# Altium schematic sheet ARC-S-MCU.SchDoc
size A3
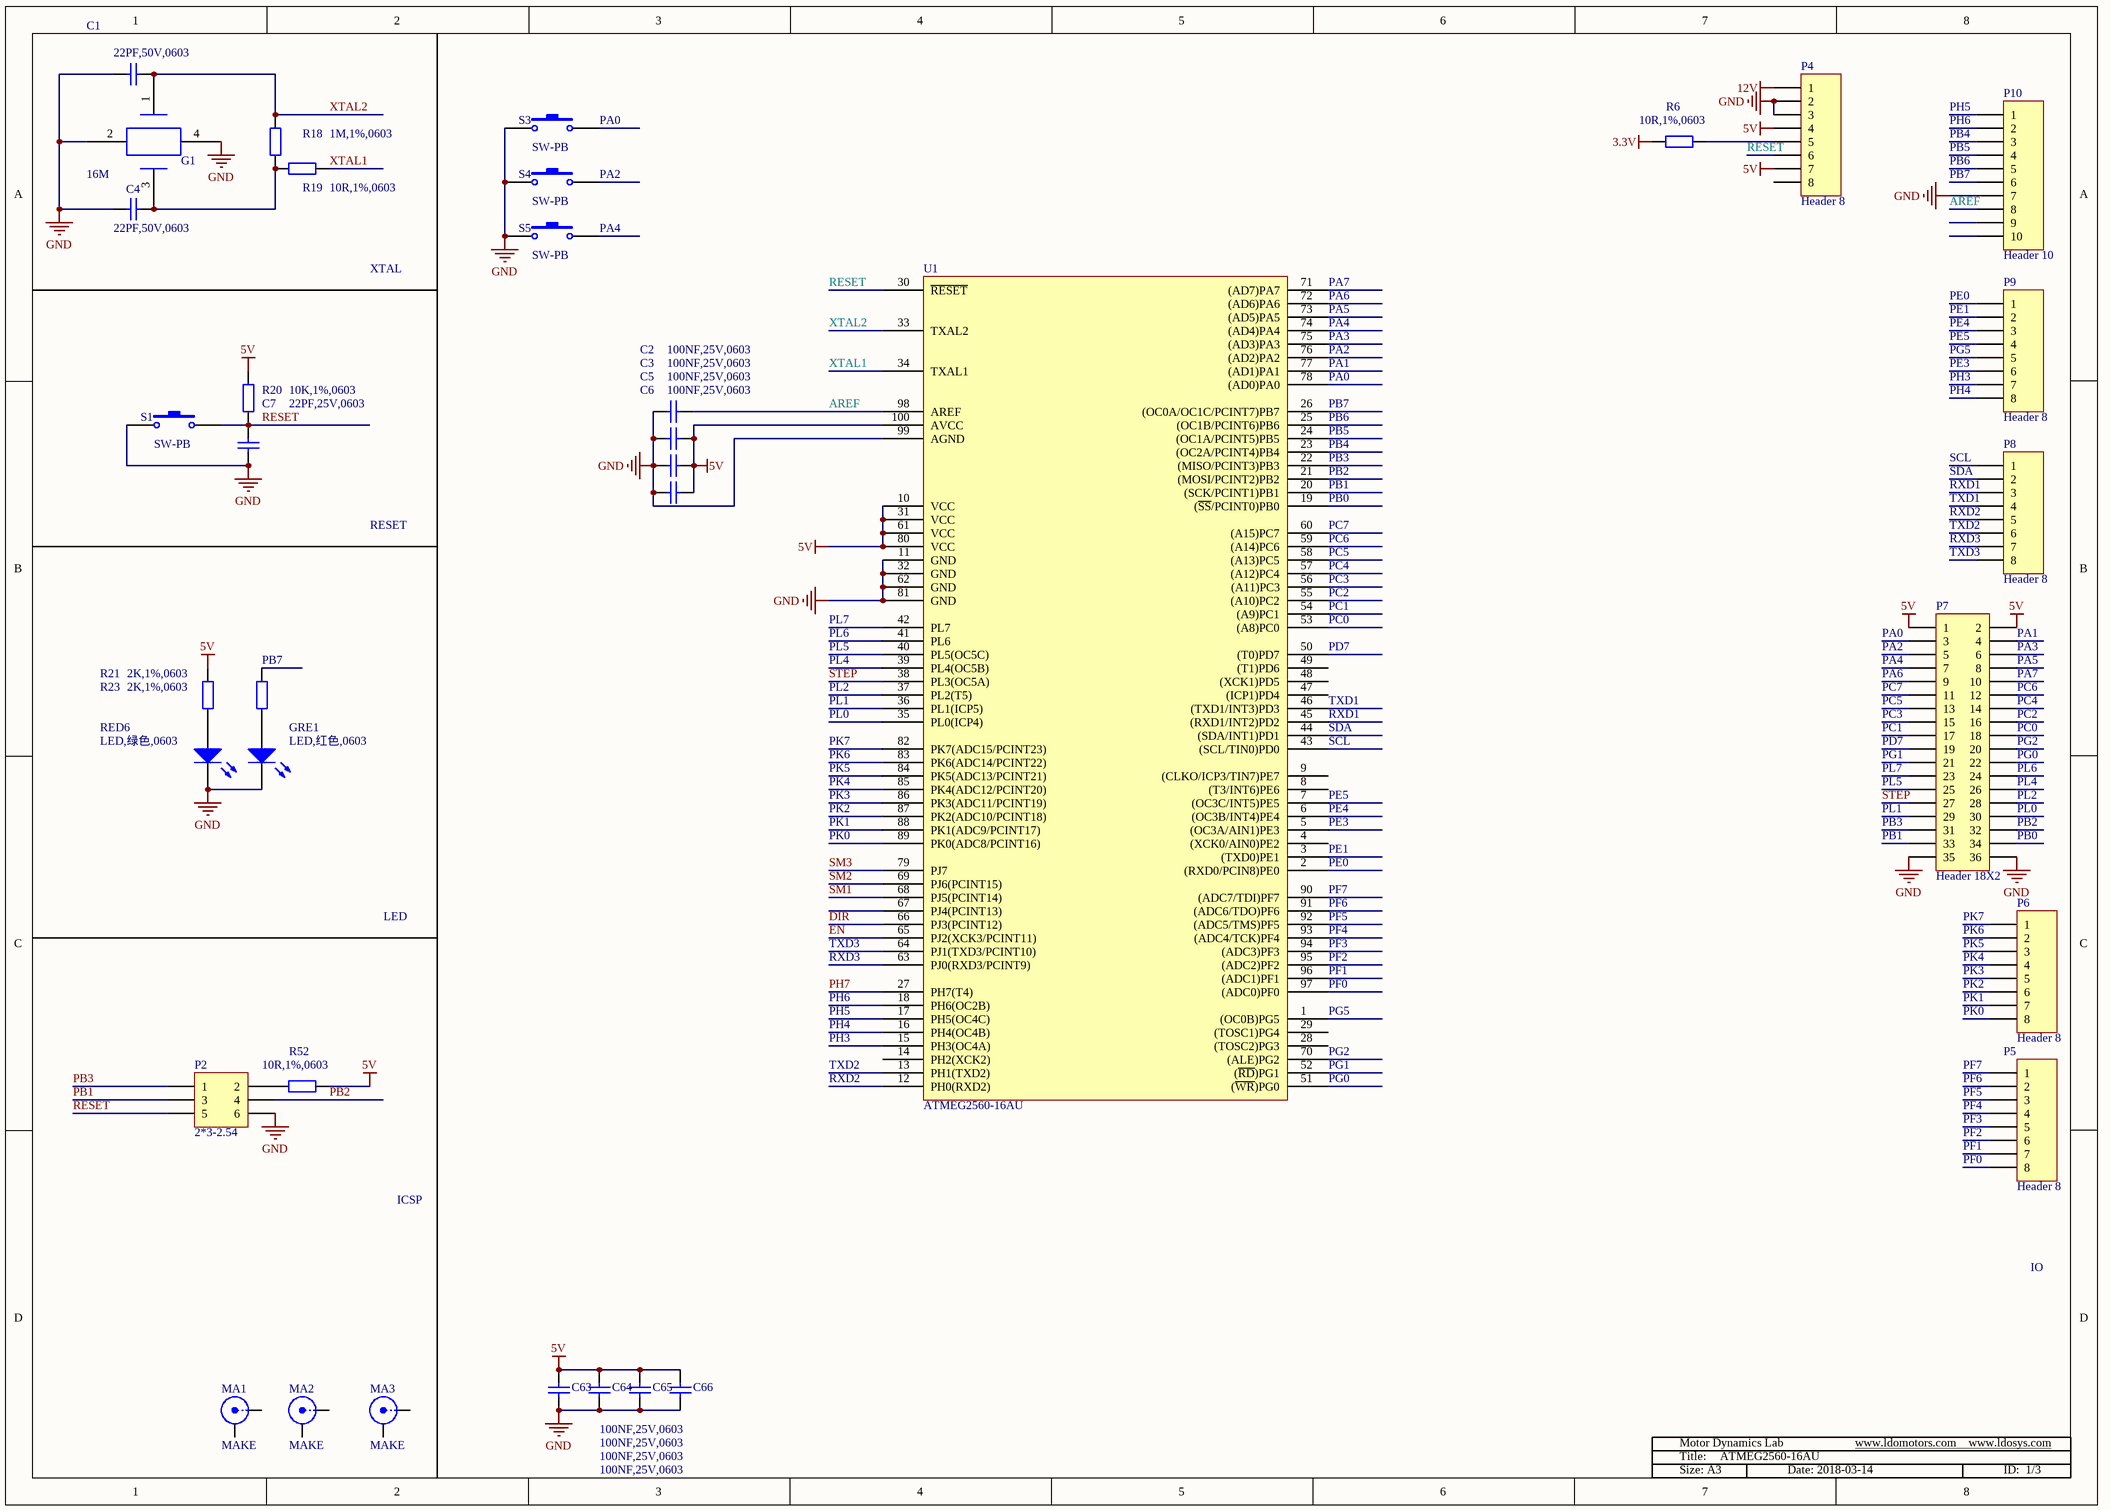
[diagram p0: ARC-S-MCU.SchDoc]

## Parts
C1  22PF,50V,0603  [RC0603]
C2  100NF,25V,0603  [RC0603]
C3  100NF,25V,0603  [RC0603]
C4  22PF,50V,0603  [RC0603]
C5  100NF,25V,0603  [RC0603]
C6  100NF,25V,0603  [RC0603]
C7  22PF,25V,0603  [RC0603]
C63  100NF,25V,0603  [RC0603]
C64  100NF,25V,0603  [RC0603]
C65  100NF,25V,0603  [RC0603]
C66  100NF,25V,0603  [RC0603]
G1  16M  [Y-3225]
GRE1  LED,红色,0603  [LED-0603]
MA1  MAKE
MA2  MAKE
MA3  MAKE
P2  2*3-2.54  [HDR2X3]
P4  Header 8  [HDR1X8]
P5  Header 8  [HDR1X8]
P6  Header 8  [HDR1X8]
P7  Header 18X2  [HDR2X18]
P8  Header 8  [HDR1X8]
P9  Header 8  [HDR1X8]
P10  Header 10  [HDR1X10]
R6  10R,1%,0603  [RC0603]
R18  1M,1%,0603  [RC0603]
R19  10R,1%,0603  [RC0603]
R20  10K,1%,0603  [RC0603]
R21  2K,1%,0603  [RC0603]
R23  2K,1%,0603  [RC0603]
R52  10R,1%,0603  [RC0603]
RED6  LED,绿色,0603  [LED-0603]
S1  SW-PB  [DIP6*6]
S3  SW-PB  [DIP6*6]
S4  SW-PB  [DIP6*6]
S5  SW-PB  [DIP6*6]
U1  ATMEG2560-16AU  [LQFP-100]

## Nets
3.3V: R6.2
5V: C3.1 C5.1 C6.1 C63.1 C64.1 C65.1 C66.1 P4.4 P4.7 P7.1 P7.2 R20.1 R23.1 R52.1 U1.10(VCC) U1.31(VCC) U1.61(VCC) U1.80(VCC) U1.100(AVCC)
12V: P4.1
GND: C1.2 C2.2 C3.2 C4.1 C5.2 C6.2 C7.2 C63.2 C64.2 C65.2 C66.2 G1.2 G1.4 GRE1.2(K) P2.6 P4.2 P4.3 P7.35 P7.36 P10.7 RED6.2(K) S1.1 S3.1 S4.1 S5.1 U1.11(GND) U1.32(GND) U1.62(GND) U1.81(GND) U1.99(AGND)
AREF: C2.1 P10.8 U1.98(AREF)
DIR: U1.66(PJ3(PCINT12))
EN: U1.65(PJ2(XCK3/PCINT11))
PA0: P7.3 S3.2 U1.78((AD0)PA0)
PA1: P7.4 U1.77((AD1)PA1)
PA2: P7.5 S4.2 U1.76((AD2)PA2)
PA3: P7.6 U1.75((AD3)PA3)
PA4: P7.7 S5.2 U1.74((AD4)PA4)
PA5: P7.8 U1.73((AD5)PA5)
PA6: P7.9 U1.72((AD6)PA6)
PA7: P7.10 U1.71((AD7)PA7)
PB0: P7.34 U1.19((~{SS}/PCINT0)PB0)
PB1: P2.3 P7.33 U1.20((SCK/PCINT1)PB1)
PB2: P2.4 P7.32 U1.21((MOSI/PCINT2)PB2)
PB3: P2.1 P7.31 U1.22((MISO/PCINT3)PB3)
PB4: P10.3 U1.23((OC2A/PCINT4)PB4)
PB5: P10.4 U1.24((OC1A/PCINT5)PB5)
PB6: P10.5 U1.25((OC1B/PCINT6)PB6)
PB7: P10.6 R21.1 U1.26((OC0A/OC1C/PCINT7)PB7)
PC0: P7.18 U1.53((A8)PC0)
PC1: P7.17 U1.54((A9)PC1)
PC2: P7.16 U1.55((A10)PC2)
PC3: P7.15 U1.56((A11)PC3)
PC4: P7.14 U1.57((A12)PC4)
PC5: P7.13 U1.58((A13)PC5)
PC6: P7.12 U1.59((A14)PC6)
PC7: P7.11 U1.60((A15)PC7)
PD7: P7.19 U1.50((T0)PD7)
PE0: P9.1 U1.2((RXD0/PCIN8)PE0)
PE1: P9.2 U1.3((TXD0)PE1)
PE3: P9.6 U1.5((OC3A/AIN1)PE3)
PE4: P9.3 U1.6((OC3B/INT4)PE4)
PE5: P9.4 U1.7((OC3C/INT5)PE5)
PF0: P5.8 U1.97((ADC0)PF0)
PF1: P5.7 U1.96((ADC1)PF1)
PF2: P5.6 U1.95((ADC2)PF2)
PF3: P5.5 U1.94((ADC3)PF3)
PF4: P5.4 U1.93((ADC4/TCK)PF4)
PF5: P5.3 U1.92((ADC5/TMS)PF5)
PF6: P5.2 U1.91((ADC6/TDO)PF6)
PF7: P5.1 U1.90((ADC7/TDI)PF7)
PG0: P7.22 U1.51((~{WR})PG0)
PG1: P7.21 U1.52((~{RD})PG1)
PG2: P7.20 U1.70((ALE)PG2)
PG5: P9.5 U1.1((OC0B)PG5)
PH3: P9.7 U1.15(PH3(OC4A))
PH4: P9.8 U1.16(PH4(OC4B))
PH5: P10.1 U1.17(PH5(OC4C))
PH6: P10.2 U1.18(PH6(OC2B))
PH7: U1.27(PH7(T4))
PK0: P6.8 U1.89(PK0(ADC8/PCINT16))
PK1: P6.7 U1.88(PK1(ADC9/PCINT17))
PK2: P6.6 U1.87(PK2(ADC10/PCINT18))
PK3: P6.5 U1.86(PK3(ADC11/PCINT19))
PK4: P6.4 U1.85(PK4(ADC12/PCINT20))
PK5: P6.3 U1.84(PK5(ADC13/PCINT21))
PK6: P6.2 U1.83(PK6(ADC14/PCINT22))
PK7: P6.1 U1.82(PK7(ADC15/PCINT23))
PL0: P7.30 U1.35(PL0(ICP4))
PL1: P7.29 U1.36(PL1(ICP5))
PL2: P7.28 U1.37(PL2(T5))
PL4: P7.26 U1.39(PL4(OC5B))
PL5: P7.25 U1.40(PL5(OC5C))
PL6: P7.24 U1.41(PL6)
PL7: P7.23 U1.42(PL7)
RESET: C7.1 P2.5 P4.6 R20.2 S1.2 U1.30(~{RESET})
RXD1: P8.3 U1.45((RXD1/INT2)PD2)
RXD2: P8.5 U1.12(PH0(RXD2))
RXD3: P8.7 U1.63(PJ0(RXD3/PCINT9))
SCL: P8.1 U1.43((SCL/TIN0)PD0)
SDA: P8.2 U1.44((SDA/INT1)PD1)
SM1: U1.68(PJ5(PCINT14))
SM2: U1.69(PJ6(PCINT15))
SM3: U1.79(PJ7)
STEP: P7.27 U1.38(PL3(OC5A))
TXD1: P8.4 U1.46((TXD1/INT3)PD3)
TXD2: P8.6 U1.13(PH1(TXD2))
TXD3: P8.8 U1.64(PJ1(TXD3/PCINT10))
XTAL1: R19.2 U1.34(TXAL1)
XTAL2: C1.1 G1.1 R18.1 U1.33(TXAL2)
NetC4_2: C4.2 G1.3 R18.2 R19.1
NetGRE1_1: GRE1.1(A) R21.2
NetP2_2: P2.2 R52.2
NetP4_5: P4.5 R6.1
NetR23_2: R23.2 RED6.1(A)

Not connected (* = marked no-connect by the designer): MA1 1(X) 2(Y); MA2 1(X) 2(Y); MA3 1(X) 2(Y); P4 8; P10 9 10; U1 4((XCK0/AIN0)PE2) 8((T3/INT6)PE6) 9((CLKO/ICP3/TIN7)PE7) 14(PH2(XCK2)) 28((TOSC2)PG3) 29((TOSC1)PG4) 47((ICP1)PD4) 48((XCK1)PD5) 49((T1)PD6) 67(PJ4(PCINT13))

## Notes on the sheet
- XTAL
- RESET
- LED
- ICSP
- IO
- Title:
- Motor Dynamics Lab
- ATMEG2560-16AU
- www.ldomotors.com    www.ldosys.com
- Size: A3
- Date: 2018-03-14
- ID:  1/3

## Library data of the parts
C1-C7 C63-C66 = Cap: Capacitor; Value: 100pF; Published: 8-Jun-2000; LatestRevisionDate: 17-Jul-2002; LatestRevisionNote: Re-released for DXP Platform.; PackageReference: RAD-0.3; Publisher: Altium Limited; PackageDescription: Radial Cap, Thru-Hole; 2 Leads; 0.3 in Pin Spacing
G1 = G
GRE1 RED6 = LED0: Typical INFRARED GaAs LED; Published: 8-Jun-2000; LatestRevisionDate: 08-Jul-2005; LatestRevisionNote: Mech Layer 1 removed.; PackageReference: LED-0; Publisher: Altium Limited; PackageDescription: LED; 2 Leads
MA1-MA3 = BNC: BNC Elbow Connector; LatestRevisionDate: 17-Jul-2002; LatestRevisionNote: Re-released for DXP Platform.; Publisher: Altium Limited
P2 = Header 3X2: Header, 3-Pin, Dual row; LatestRevisionDate: 17-Jul-2002; LatestRevisionNote: Re-released for DXP Platform.; Publisher: Altium Limited
P4-P6 P8 P9 = Header 8: Header, 8-Pin; LatestRevisionDate: 17-Jul-2002; LatestRevisionNote: Re-released for DXP Platform.; Publisher: Altium Limited
P7 = Header 18X2: Header, 18-Pin, Dual row; LatestRevisionDate: 17-Jul-2002; LatestRevisionNote: Re-released for DXP Platform.; Publisher: Altium Limited
P10 = Header 10: Header, 10-Pin; LatestRevisionDate: 17-Jul-2002; LatestRevisionNote: Re-released for DXP Platform.; Publisher: Altium Limited
R6 R18-R21 R23 R52 = Res2: Resistor; Value: 1K; Published: 8-Jun-2000; LatestRevisionDate: 17-Jul-2002; LatestRevisionNote: Re-released for DXP Platform.; PackageReference: AXIAL-0.4; Publisher: Altium Limited; PackageDescription: Axial Device, Thru-Hole; 2 Leads; 0.4 in Pin Spacing
S1 S3-S5 = SW-PB: Switch; Published: 24-Mar-1999; LatestRevisionDate: 17-Jul-2002; LatestRevisionNote: Re-released for DXP Platform.; PackageReference: SPST-2; Publisher: Altium Limited; PackageDescription: Switch; 2 Leads